# EAGLE design 411_Preliminary Design_ Group8_rev4_5 (EAGLE 9.6.2)
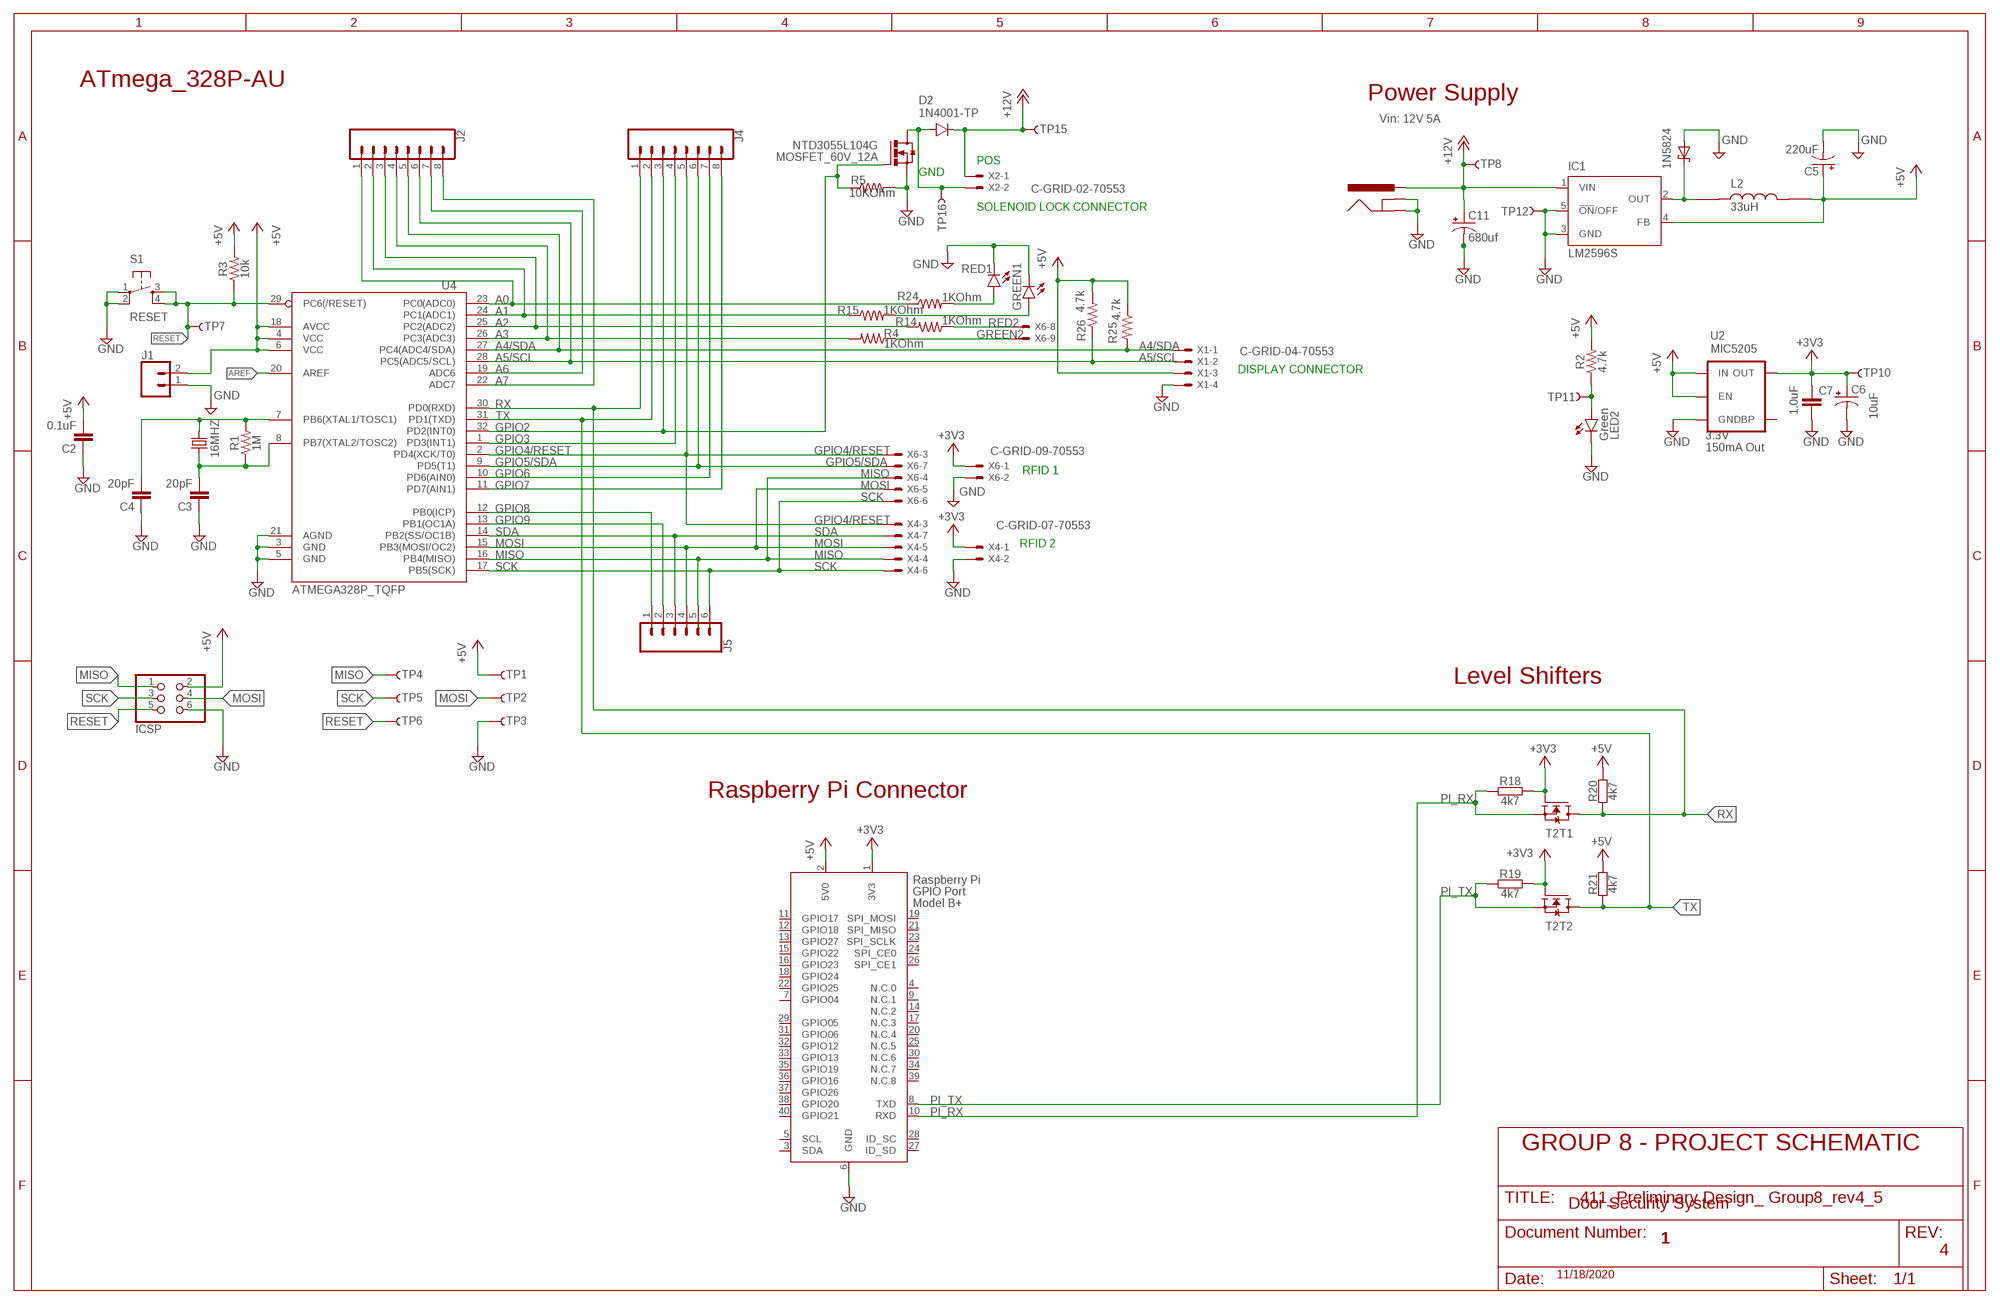
[diagram p0: schematic, sheet 1]

## Parts
1N5824  SCHOTTKY-DIODECB429-15  [CB429-15]
16MHZ  16MHZ  CRYSTALHC49S  [HC49/S]
C2  0.1uF  0.1UF-0603-25V-(+80/-20%)  [0603]
C3  20pF  0.1UF-0603-25V-(+80/-20%)  [0603]
C4  20pF  0.1UF-0603-25V-(+80/-20%)  [0603]
C5  220uF  CPOL-US153CLV-0605  [153CLV-0605]
C6  10uF  10UF-POLAR-EIA3216-16V-10%(TANT)  [EIA3216]
C7  1.0uF  1.0UF-0603-16V-10%  [0603]
C11  680uf  CPOL-US153CLV-0605  [153CLV-0605]
D2  1N4001-TP  1N4004  [DO41-10]
GREEN1  LED5MM  [LED5MM]
IC1  LM2596S  [TO263-5]
ICSP  ICSP  PINHD-2X3  [2X03]
J1  CONN_02  [1X02]
J2  CONN_08"  [1X08]
J3  POWER_JACKSUPER_BOMB_DIGITY  [POWER_JACK_SMD_OVERPASTE_SUPER_BOMB_DIGITY]
J4  CONN_08"  [1X08]
J5  CONN_06SILK_FEMALE_PTH  [1X06]
L2  33uH  #B953AS-330M=P3  [IND_#B953AS-330M=P3]
LED2  Green  LED1206  [LED-1206]
MOSFET_60V_12A  NTD3055L104G  [DPAK3]
R1  1M  10KOHM-0603-1/10W-1%  [0603]
R2  4.7k  4.7KOHM-0603-1/10W-1%  [0603]
R3  10k  10KOHM-0603-1/10W-1%  [0603]
R4  1KOhm  R-US_M1406  [M1406]
R5  10KOhm  R-US_M1406  [M1406]
R14  1KOhm  R-US_M1406  [M1406]
R15  1KOhm  R-US_M1406  [M1406]
R18  4k7  RESISTOR-0402  [C0402]
R19  4k7  RESISTOR-0402  [C0402]
R20  4k7  RESISTOR-0402  [C0402]
R21  4k7  RESISTOR-0402  [C0402]
R24  1KOhm  R-US_M1406  [M1406]
R25  4.7k  4.7KOHM-0603-1/10W-1%  [0603]
R26  4.7k  4.7KOHM-0603-1/10W-1%  [0603]
RED1  LED5MM  [LED5MM]
S1  RESET  SWITCH_SPST_4_PINSQUARE  [TACTILE-SWITCH-SMD]
T2  BSS138PS  [SOT363]
TP1  TP-3x5  TEST-POINT3X5  [PAD.03X.05]
TP2  TP-3x5  TEST-POINT3X5  [PAD.03X.05]
TP3  TP-3x5  TEST-POINT3X5  [PAD.03X.05]
TP4  TP-3x5  TEST-POINT3X5  [PAD.03X.05]
TP5  TP-3x5  TEST-POINT3X5  [PAD.03X.05]
TP6  TP-3x5  TEST-POINT3X5  [PAD.03X.05]
TP7  TP-3x5  TEST-POINT3X5  [PAD.03X.05]
TP8  TP-3x5  TEST-POINT3X5  [PAD.03X.05]
TP10  TP-3x5  TEST-POINT3X5  [PAD.03X.05]
TP11  TP-3x5  TEST-POINT3X5  [PAD.03X.05]
TP12  TP-3x5  TEST-POINT3X5  [PAD.03X.05]
TP15  TP-3x5  TEST-POINT3X5  [PAD.03X.05]
TP16  TP-3x5  TEST-POINT3X5  [PAD.03X.05]
U2  MIC5205  MIC52053.3V  [SOT23-5]
U4  ATMEGA328P_TQFP  [TQFP32-08]
X1  C-GRID-04-70553  [70553-04]
X2  C-GRID-02-70553  [70553-02]
X4  C-GRID-07-70553  [70553-07]
X5  RASPI_BOARD_B+_E4P  [RASPI_BOARD_B+_EDGES_4DRILL_PAD]
X6  C-GRID-09-70553  [70553-09]

## Nets
+3V3: C6.+ C7.1 R18.2 R19.2 T2.2(T1:G) T2.5(T2:G) TP10.P$1 U2.5(OUT) X4.1 X5.1(3V3) X6.1
+5V: C2.2 C5.+ IC1.4(FB) ICSP.2 J1.2 L2.2 R2.2 R3.2 R20.2 R21.2 R25.1 R26.2 TP1.P$1 U2.1(IN) U2.3(EN) U4.4(VCC) U4.6(VCC) U4.18(AVCC) X1.3 X5.2(5V0)
+12V: C11.+ D2.C IC1.1(VIN) J3.VIN0(PWR) TP8.P$1 TP15.P$1 X2.1
A0: J2.1 R24.1 U4.23(PC0(ADC0))
A1: J2.2 R15.1 U4.24(PC1(ADC1))
A2: J2.3 R14.2 U4.25(PC2(ADC2))
A3: J2.4 R4.2 U4.26(PC3(ADC3))
A4/SDA: J2.5 R25.2 U4.27(PC4(ADC4/SDA)) X1.1
A5/SCL: J2.6 R26.1 U4.28(PC5(ADC5/SCL)) X1.2
A6: J2.7 U4.19(ADC6)
A7: J2.8 U4.22(ADC7)
AREF: U4.20(AREF)
GND: 1N5824.A C2.1 C3.1 C4.1 C5.- C6.- C7.2 C11.- GREEN1.K(C) IC1.3(GND) IC1.5(!ON!/OFF) ICSP.6 J1.1 J3.GND(GNDBREAK) J3.P$4(GND) LED2.C MOSFET_60V_12A.2(S) R5.2 RED1.K(C) S1.1 S1.2 TP3.P$1 TP12.P$1 U2.2(GND) U4.3(GND) U4.5(GND) U4.21(AGND) X1.4 X4.2 X5.6(GND) X6.2
GPIO2: J4.3 MOSFET_60V_12A.1(G) R5.1 U4.32(PD2(INT0))
GPIO3: J4.4 U4.1(PD3(INT1))
GPIO4/RESET: J4.5 U4.2(PD4(XCK/T0)) X4.3 X6.3
GPIO5/SDA: J4.6 U4.9(PD5(T1)) X6.7
GPIO6: J4.7 U4.10(PD6(AIN0))
GPIO7: J4.8 U4.11(PD7(AIN1))
GPIO8: J5.1 U4.12(PB0(ICP))
GPIO9: J5.2 U4.13(PB1(OC1A))
GREEN2: R4.1 X6.9
MISO: ICSP.1 J5.5 TP4.P$1 U4.16(PB4(MISO)) X4.4 X6.4
MOSI: ICSP.4 J5.4 TP2.P$1 U4.15(PB3(MOSI/OC2)) X4.5 X6.5
N$1: 1N5824.C IC1.2(OUT) L2.1
N$2: LED2.A R2.1 TP11.P$1
N$3: 16MHZ.2 C4.2 R1.2 U4.7(PB6(XTAL1/TOSC1))
N$4: 16MHZ.1 C3.2 R1.1 U4.8(PB7(XTAL2/TOSC2))
N$5: D2.A MOSFET_60V_12A.3(D) TP16.P$1 X2.2
N$9: GREEN1.A R15.2
N$12: R24.2 RED1.A
PI_RX: R18.1 T2.1(T1:S) X5.10(RXD)
PI_TX: R19.1 T2.4(T2:S) X5.8(TXD)
RED2: R14.1 X6.8
RESET: ICSP.5 R3.1 S1.3 S1.4 TP6.P$1 TP7.P$1 U4.29(PC6(/RESET))
RX: J4.1 R20.1 T2.6(T1:D) U4.30(PD0(RXD))
SCK: ICSP.3 J5.6 TP5.P$1 U4.17(PB5(SCK)) X4.6 X6.6
SDA: J5.3 U4.14(PB2(SS/OC1B)) X4.7
TX: J4.2 R21.1 T2.3(T2:D) U4.31(PD1(TXD))
Unconnected: U2.4(BP) X5.3(SDA) X5.4(N.C.0) X5.5(SCL) X5.7(GPIO04) X5.9(N.C.1) X5.11(GPIO17) X5.12(GPIO18) X5.13(GPIO27) X5.14(N.C.2) X5.15(GPIO22) X5.16(GPIO23) X5.17(N.C.3) X5.18(GPIO24) X5.19(SPI_MOSI) X5.20(N.C.4) X5.21(SPI_MISO) X5.22(GPIO25) X5.23(SPI_SCLK) X5.24(SPI_CE0) X5.25(N.C.5) X5.26(SPI_CE1) X5.27(ID_SD) X5.28(ID_SC) X5.29(GPIO05) X5.30(N.C.6) X5.31(GPIO06) X5.32(GPIO12) X5.33(GPIO13) X5.34(N.C.7) X5.35(GPIO19) X5.36(GPIO16) X5.37(GPIO26) X5.38(GPIO20) X5.39(N.C.8) X5.40(GPIO21)

## Notes on the sheet
- ATmega_328P-AU
- Power Supply
- Vin: 12V 5A
- POS
- GND
- SOLENOID LOCK CONNECTOR
- DISPLAY CONNECTOR
- 3.3V
  150mA Out
- RFID 1
- RFID 2
- Level Shifters
- Level Shifter
- Raspberry Pi Connector
- GROUP 8 - PROJECT SCHEMATIC
- Door Security System
- 1
- 4
- 11/18/2020

## Library data of the parts
1N5824 = adafruit:SCHOTTKY-DIODE: Schottky Diode
16MHZ = crystal:CRYSTAL: CRYSTAL; OC_FARNELL: 1667008; OC_NEWARK: unknown
C2 = SparkFun-Capacitors:0.1UF: 0.1µF ceramic capacitors A capacitor is a passive two-terminal electrical component used to store electrical energy temporarily in an electric field.; PROD_ID: CAP-00810
C3 C4 = SparkFun-Capacitors:0.1UF: 0.1µF ceramic capacitors A capacitor is a passive two-terminal electrical component used to store electrical energy temporarily in an electric field.; PROD_ID: CAP-00810; VALUE: 0.1uF
C5 C11 = rcl:CPOL-US: POLARIZED CAPACITOR, American symbol; SPICEPREFIX: C
C6 = SparkFun-Capacitors:10UF-POLAR: 10.0µF polarized capacitors A capacitor is a passive two-terminal electrical component used to store electrical energy temporarily in an electric field.; PROD_ID: CAP-00811
C7 = SparkFun-Capacitors:1.0UF: 1µF ceramic capacitors A capacitor is a passive two-terminal electrical component used to store electrical energy temporarily in an electric field.; PROD_ID: CAP-00868
D2 = diode:1N4004: DIODE general purpose rectifier, 1 A
GREEN1 = led:LED: LED OSRAM: - CHIPLED LG R971, LG N971, LY N971, LG Q971, LY Q971, LO R971, LY R971 LH N974, LH R974 LS Q976, LO Q976, LY Q976 LO Q996 - Hyper CHIPLED LW Q18S LB Q993, LB Q99A, LB R99A - SideLED LS A670, LO A670, LY A670, LG A670, LP A670 LB A673, LV A673, LT A673, LW A673 LH A674 LY A675 LS A676, LA A676, LO A676, LY A676, LW A676 LS A679, LY A679, LG A679 - Hyper Micro SIDELED® LS Y876, LA Y876, LO Y876, LY Y876 LT Y87S - SmartLED LW L88C, LW L88S LB L89C, LB L89S, LG L890 LS L89K, LO L89K, LY L89K LS L896, LA L896, LO L896, LY L896 - TOPLED LS T670, LO T670, LY T670, LG T670, LP T670 LSG T670, LSP T670, LSY T670, LOP T670, LYG T670 LG T671, LOG T671, LSG T671 LB T673, LV T673, LT T673, LW T673 LH T674 LS T676, LA T676, LO T676, LY T676, LB T676, LH T676, LSB T676, LW T676 LB T67C, LV T67C, LT T67C, LS T67K, LO T67K, LY T67K, LW E67C LS E67B, LA E67B, LO E67B, LY E67B, LB E67C, LV E67C, LT E67C LW T67C LS T679, LY T679, LG T679 LS T770, LO T770, LY T770, LG T770, LP T770 LB T773, LV T773, LT T773, LW T773 LH T774 LS E675, LA E675, LY E675, LS T675 LS T776, LA T776, LO T776, LY T776, LB T776 LHGB T686 LT T68C, LB T68C - Hyper Mini TOPLED® LB M676 - Mini TOPLED Santana® LG M470 LS M47K, LO M47K, LY M47K Source: http://www.osram.convergy.de LUXEON: - LUMILED® LXK2-PW12-R00, LXK2-PW12-S00, LXK2-PW14-U00, LXK2-PW14-V00 LXK2-PM12-R00, LXK2-PM12-S00, LXK2-PM14-U00 LXK2-PE12-Q00, LXK2-PE12-R00, LXK2-PE12-S00, LXK2-PE14-T00, LXK2-PE14-U00 LXK2-PB12-K00, LXK2-PB12-L00, LXK2-PB12-M00, LXK2-PB14-N00, LXK2-PB14-P00, LXK2-PB14-Q00 LXK2-PR12-L00, LXK2-PR12-M00, LXK2-PR14-Q00, LXK2-PR14-R00 LXK2-PD12-Q00, LXK2-PD12-R00, LXK2-PD12-S00 LXK2-PH12-R00, LXK2-PH12-S00 LXK2-PL12-P00, LXK2-PL12-Q00, LXK2-PL12-R00 Source: www.luxeon.com KINGBRIGHT: KA-3528ASYC Source: www.kingbright.com
IC1 = national-semiconductor:LM2596: SIMPLE SWITCHER® Power Converter 150 kHz 3A Step-Down Voltage Regulator Source: http://www.national.com/ds/LM/LM2596.pdf; MF: NATIONAL SEMICONDUCTOR; MPN: LM2596S-ADJ/NOPB; OC_FARNELL: 9494367; OC_NEWARK: 41K3842
ICSP = pinhead:PINHD-2X3: PIN HEADER
J1 = SparkFun-Connectors:CONN_02: Multi connection point. Often used as Generic Header-pin footprint for 0.1 inch spaced/style header connections On any of the 0.1 inch spaced packages, you can populate with these: Break Away Headers - Straight <https://www.sparkfun.com/products/116> (PRT-00116) Break Away Male Headers - Right Angle <https://www.sparkfun.com/products/553> (PRT-00553) Female Headers <https://www.sparkfun.com/products/115> (PRT-00115) Break Away Headers - Machine Pin <https://www.sparkfun.com/products/117> (PRT-00117) Break Away Female Headers - Swiss Machine Pin <https://www.sparkfun.com/products/743> (PRT-00743) For SCREWTERMINALS and SPRING TERMINALS visit here: Screw Terimnals on SparkFun.com <https://www.sparkfun.com/search/results?term=Screw+Terminals> (5mm/3.5mm/2.54mm spacing) This device is also useful as a general connection point to wire up your design to another part of your project. Our various solder wires solder well into these plated through hole pads. Hook-Up Wire - Assortment (Stranded, 22 AWG) <https://www.sparkfun.com/products/11375> (PRT-11375) Hook-Up Wire - Assortment (Solid Core, 22 AWG) <https://www.sparkfun.com/products/11367> (PRT-11367) View the entire wire category on our website here <https://www.sparkfun.com/categories/141> Special notes: Molex polarized connector foot print use with: PRT-08233 with associated crimp pins and housings. 2.54_SCREWTERM for use with PRT-10571. 3.5mm Screw Terminal footprints for PRT-08084 5mm Screw Terminal footprints for use with PRT-08432
J2 J4 = SparkFun-Connectors:CONN_08: Multi connection point. Often used as Generic Header-pin footprint for 0.1 inch spaced/style header connections On any of the 0.1 inch spaced packages, you can populate with these: Break Away Headers - Straight <https://www.sparkfun.com/products/116> (PRT-00116) Break Away Male Headers - Right Angle <https://www.sparkfun.com/products/553> (PRT-00553) Female Headers <https://www.sparkfun.com/products/115> (PRT-00115) Break Away Headers - Machine Pin <https://www.sparkfun.com/products/117> (PRT-00117) Break Away Female Headers - Swiss Machine Pin <https://www.sparkfun.com/products/743> (PRT-00743) Arduino Stackable Header - 8 Pin <https://www.sparkfun.com/products/9279> (PRT-09279) For SCREWTERMINALS and SPRING TERMINALS visit here: Screw Terimnals on SparkFun.com <https://www.sparkfun.com/search/results?term=Screw+Terminals> (5mm/3.5mm/2.54mm spacing) This device is also useful as a general connection point to wire up your design to another part of your project. Our various solder wires solder well into these plated through hole pads. Hook-Up Wire - Assortment (Stranded, 22 AWG) <https://www.sparkfun.com/products/11375> (PRT-11375) Hook-Up Wire - Assortment (Solid Core, 22 AWG) <https://www.sparkfun.com/products/11367> (PRT-11367) View the entire wire category on our website here <https://www.sparkfun.com/categories/141> Special notes: Molex polarized connector foot print use with SKU : PRT-08231 with associated crimp pins and housings. 1MM SMD Version SKU: PRT-10208 NOTES ON THE VARIANTS LOCK and LOCK_LONGPADS... This footprint was designed to help hold the alignment of a through-hole component (i.e. 6-pin header) while soldering it into place. You may notice that each hole has been shifted either up or down by 0.005 of an inch from it's more standard position (which is a perfectly straight line). This slight alteration caused the pins (the squares in the middle) to touch the edges of the holes. Because they are alternating, it causes a "brace" to hold the component in place. 0.005 has proven to be the perfect amount of "off-center" position when using our standard breakaway headers. Although looks a little odd when you look at the bare footprint, once you have a header in there, the alteration is very hard to notice. Also,if you push a header all the way into place, it is covered up entirely on the bottom side.; PROD_ID: CONN-08438
J3 = Testing:POWER_JACK: Power Jack This is the standard 5.5mm barrel jack for power. The PTH is the most common, proven, reliable, footprint. All others are experimental. The Slot footprint only works if the mill layer is transmitted to the PCB fab house so be warned. Spark Fun Electronics SKU : PRT-00119. Mating wall wart : TOL-00298 (and others); PROD_ID: CONN-08106
J5 = SparkFun-Connectors:CONN_06: Multi connection point. Often used as Generic Header-pin footprint for 0.1 inch spaced/style header connections On any of the 0.1 inch spaced packages, you can populate with these: Break Away Headers - Straight <https://www.sparkfun.com/products/116> (PRT-00116) Break Away Male Headers - Right Angle <https://www.sparkfun.com/products/553> (PRT-00553) Female Headers <https://www.sparkfun.com/products/115> (PRT-00115) Break Away Headers - Machine Pin <https://www.sparkfun.com/products/117> (PRT-00117) Break Away Female Headers - Swiss Machine Pin <https://www.sparkfun.com/products/743> (PRT-00743) Arduino Stackable Header - 6 Pin <https://www.sparkfun.com/products/9280> (PRT-09280) For SCREWTERMINALS and SPRING TERMINALS visit here: Screw Terimnals on SparkFun.com <https://www.sparkfun.com/search/results?term=Screw+Terminals> (5mm/3.5mm/2.54mm spacing) This device is also useful as a general connection point to wire up your design to another part of your project. Our various solder wires solder well into these plated through hole pads. Hook-Up Wire - Assortment (Stranded, 22 AWG) <https://www.sparkfun.com/products/11375> (PRT-11375) Hook-Up Wire - Assortment (Solid Core, 22 AWG) <https://www.sparkfun.com/products/11367> (PRT-11367) View the entire wire category on our website here <https://www.sparkfun.com/categories/141>; PROD_ID: CONN-08437
L2 = _B953AS-330M_P3:#B953AS-330M=P3: Inductor Power Shielded Wirewound 3.9uH 30% 100KHz Ferrite 6A 0.014Ohm DCR 4949 T/R; DESCRIPTION: Inductor with Inductance: 33uH Tol. +/-20%, Package: 4949 (125125); DIGI-KEY_PART_NUMBER: 490-14099-1-ND; MF: Murata; MP: #B953AS-330M=P3; PACKAGE: NONSTANDARD
LED2 = SparkFun-LED:LED: LED (Generic) Standard schematic elements and footprints for 5mm, 3mm, 1206, and 0603 sized LEDs. Generic LEDs with no color specified.; PROD_ID: DIO-09910
MOSFET_60V_12A = Transistor:NTD3055L104G: 12 A, 60 V, Logic Level N−Channel DPAK/IPAK Manufacturer's datasheet <https://www.onsemi.com/pub/Collateral/NTD3055L104-D.PDF>; CREATED_BY: PCBLayout.com; MANUFACTURER: ON SEMICONDUCTORS; MPN: NTD3055L104G; PACKAGE: DPAK-4
R1 = SparkFun-Resistors:10KOHM: 10kΩ resistor A resistor is a passive two-terminal electrical component that implements electrical resistance as a circuit element. Resistors act to reduce current flow, and, at the same time, act to lower voltage levels within circuits. - Wikipedia; PROD_ID: RES-00824; VALUE: 10k
R2 R25 R26 = SparkFun-Resistors:4.7KOHM: 4.7kΩ resistor A resistor is a passive two-terminal electrical component that implements electrical resistance as a circuit element. Resistors act to reduce current flow, and, at the same time, act to lower voltage levels within circuits. - Wikipedia; PROD_ID: RES-07857
R3 = SparkFun-Resistors:10KOHM: 10kΩ resistor A resistor is a passive two-terminal electrical component that implements electrical resistance as a circuit element. Resistors act to reduce current flow, and, at the same time, act to lower voltage levels within circuits. - Wikipedia; PROD_ID: RES-00824
R4 R5 R14 R15 R24 = rcl:R-US_: RESISTOR, American symbol; SPICEPREFIX: R
R18-R21 = we-rcl:RESISTOR: Resistors all kinds in 0603 and 0402
RED1 = led:LED: LED OSRAM: - CHIPLED LG R971, LG N971, LY N971, LG Q971, LY Q971, LO R971, LY R971 LH N974, LH R974 LS Q976, LO Q976, LY Q976 LO Q996 - Hyper CHIPLED LW Q18S LB Q993, LB Q99A, LB R99A - SideLED LS A670, LO A670, LY A670, LG A670, LP A670 LB A673, LV A673, LT A673, LW A673 LH A674 LY A675 LS A676, LA A676, LO A676, LY A676, LW A676 LS A679, LY A679, LG A679 - Hyper Micro SIDELED® LS Y876, LA Y876, LO Y876, LY Y876 LT Y87S - SmartLED LW L88C, LW L88S LB L89C, LB L89S, LG L890 LS L89K, LO L89K, LY L89K LS L896, LA L896, LO L896, LY L896 - TOPLED LS T670, LO T670, LY T670, LG T670, LP T670 LSG T670, LSP T670, LSY T670, LOP T670, LYG T670 LG T671, LOG T671, LSG T671 LB T673, LV T673, LT T673, LW T673 LH T674 LS T676, LA T676, LO T676, LY T676, LB T676, LH T676, LSB T676, LW T676 LB T67C, LV T67C, LT T67C, LS T67K, LO T67K, LY T67K, LW E67C LS E67B, LA E67B, LO E67B, LY E67B, LB E67C, LV E67C, LT E67C LW T67C LS T679, LY T679, LG T679 LS T770, LO T770, LY T770, LG T770, LP T770 LB T773, LV T773, LT T773, LW T773 LH T774 LS E675, LA E675, LY E675, LS T675 LS T776, LA T776, LO T776, LY T776, LB T776 LHGB T686 LT T68C, LB T68C - Hyper Mini TOPLED® LB M676 - Mini TOPLED Santana® LG M470 LS M47K, LO M47K, LY M47K Source: http://www.osram.convergy.de LUXEON: - LUMILED® LXK2-PW12-R00, LXK2-PW12-S00, LXK2-PW14-U00, LXK2-PW14-V00 LXK2-PM12-R00, LXK2-PM12-S00, LXK2-PM14-U00 LXK2-PE12-Q00, LXK2-PE12-R00, LXK2-PE12-S00, LXK2-PE14-T00, LXK2-PE14-U00 LXK2-PB12-K00, LXK2-PB12-L00, LXK2-PB12-M00, LXK2-PB14-N00, LXK2-PB14-P00, LXK2-PB14-Q00 LXK2-PR12-L00, LXK2-PR12-M00, LXK2-PR14-Q00, LXK2-PR14-R00 LXK2-PD12-Q00, LXK2-PD12-R00, LXK2-PD12-S00 LXK2-PH12-R00, LXK2-PH12-S00 LXK2-PL12-P00, LXK2-PL12-Q00, LXK2-PL12-R00 Source: www.luxeon.com KINGBRIGHT: KA-3528ASYC Source: www.kingbright.com; SPICEPREFIX: L
S1 = SparkFun-Electromechanical:SWITCH_SPST_4_PIN; PROD_ID: SWCH-08247
T2 = we-transistor:BSS138PS: BSS138 Dual N-Channel MOSFET (UGS +/-20V, RDS 1Ohm, ID 320mA)
TP1-TP4 TP6-TP8 TP10-TP12 TP15 TP16 = SparkFun-Connectors:TEST-POINT: SparkFun Test Points Bare copper test points for troubleshooting or In-Circuit-Testing. These are used by our Production team for verifying production board runs using pogo-pins on test beds. SparkFun Products: SparkFun LSM9DS1 Breakout <https://www.sparkfun.com/products/13284> SparkFun PSOC <https://www.sparkfun.com/products/13714> SparkFun Load Cell Amplifier <https://www.sparkfun.com/products/13879>
TP5 = SparkFun-Passives:TEST-POINT: Bare copper test points for troubleshooting or ICT
U2 = SparkFun-PowerIC:MIC5205: MIC5205 150mA vreg 3.3V - VREG-00822 5V - VREG-00823; PROD_ID: VREG-00822
U4 = SparkFun-IC-Microcontroller:ATMEGA328P_TQFP: Popular 328P in QFP Storefront component: ATmega328 - TQFP <https://www.sparkfun.com/products/13448> (COM-13448) Datasheet <http://www.sparkfun.com/datasheets/Components/SMD/ATMega328.pdf> SparkFun Products SparkFun RedBoard - Programmed with Arduino <https://www.sparkfun.com/products/12757> (DEV-12757) Arduino Pro Mini 328 - 5V/16MHz <https://www.sparkfun.com/products/11113> (DEV-11113) Arduino Pro Mini 328 - 3.3V/8MHz <https://www.sparkfun.com/products/11114> (DEV-11114) SparkFun OpenLog <https://www.sparkfun.com/products/13712> (DEV-13712) SparkFun MicroView - OLED Arduino Module <https://www.sparkfun.com/products/12923> (DEV-12923) SparkFun Digital Sandbox <https://www.sparkfun.com/products/12651> (DEV-12651) SparkFun PicoBoard <https://www.sparkfun.com/products/11888> (WIG-11888) Arduino Fio <https://www.sparkfun.com/products/10116> (DEV-10116) LilyPad Arduino 328 Main Board <https://www.sparkfun.com/products/13342> (DEV-13342) SparkFun RedStick <https://www.sparkfun.com/products/13741> (DEV-13741) LilyPad MP3 <https://www.sparkfun.com/products/11013> (DEV-11013) LilyPad Arduino SimpleSnap <https://www.sparkfun.com/products/10941> (DEV-10941) SparkFun Stepoko <https://www.sparkfun.com/products/13899> (ROB-13899) SparkFun Geiger Counter <https://www.sparkfun.com/products/11345> (SEN-11345) SparkFun EL Sequencer <https://www.sparkfun.com/products/12781> (COM-12781) Arduino Pro 328 - 5V/16MHz <https://www.sparkfun.com/products/10915> (DEV-10915) CryptoCape <https://www.sparkfun.com/products/12773> (DEV-12773) SparkFun IR Thermometer Evaluation Board - MLX90614 <https://www.sparkfun.com/products/10740> (SEN-10740) SparkFun RedBot Mainboard <https://www.sparkfun.com/products/12097> (ROB-12097) Arduino Pro 328 - 3.3V/8MHz <https://www.sparkfun.com/products/10914> (DEV-10914) SparkFun Block for Intel® Edison - Arduino <https://www.sparkfun.com/products/13036> (DEV-13036) SparkFun Simon Says - Surface Mount Soldering Kit <https://www.sparkfun.com/products/10935> (KIT-10935) SparkFun 7-Segment Serial Display - Red <https://www.sparkfun.com/products/11441> (COM-11441) SparkFun 7-Segment Serial Display - White <https://www.sparkfun.com/products/11629> (COM-11629) SparkFun 7-Segment Serial Display - Yellow <https://www.sparkfun.com/products/11443> (COM-11443) SparkFun 7-Segment Serial Display - Kelly Green <https://www.sparkfun.com/products/11440> (COM-11440) SparkFun 7-Segment Serial Display - Blue <https://www.sparkfun.com/products/11442> (COM-11442) SparkFun OpenSegment Serial Display - 20mm (Blue) <https://www.sparkfun.com/products/11647> (COM-11647) SparkFun OpenSegment Serial Display - 20mm (Green) <https://www.sparkfun.com/products/11646> (COM-11646) SparkFun OpenSegment Serial Display - 20mm (White) <https://www.sparkfun.com/products/11648> (COM-11648) SparkFun OpenSegment Serial Display - 20mm (Red) <https://www.sparkfun.com/products/11644> (COM-11644) SparkFun OpenSegment Serial Display - 20mm (Yellow) <https://www.sparkfun.com/products/11645> (COM-11645) SparkFun OpenSegment Shield <https://www.sparkfun.com/products/13190> (DEV-13190); PROD_ID: IC-09069
X1 = con-molex:C-GRID-04: CONNECTOR wire to board 2.54 mm (0.100") pitch header; MF: MOLEX; OC_FARNELL: unknown; OC_NEWARK: unknown
X2 = con-molex:C-GRID-02: CONNECTOR wire to board 2.54 mm (0.100") pitch header; MF: MOLEX; OC_FARNELL: unknown; OC_NEWARK: unknown
X4 = con-molex:C-GRID-07: CONNECTOR wire to board 2.54 mm (0.100") pitch header; MF: MOLEX; OC_FARNELL: unknown; OC_NEWARK: unknown
X5 = raspberrypi_bastelstube_v13:RASPI_BOARD_B+: Raspberry Pi GPIO connector with markings for the outer dimensions of the Raspberry Pi board model B+ with different sets of drill holes or mounting pads
X6 = con-molex:C-GRID-09: CONNECTOR wire to board 2.54 mm (0.100") pitch header; MF: MOLEX; OC_FARNELL: unknown; OC_NEWARK: unknown

## Board
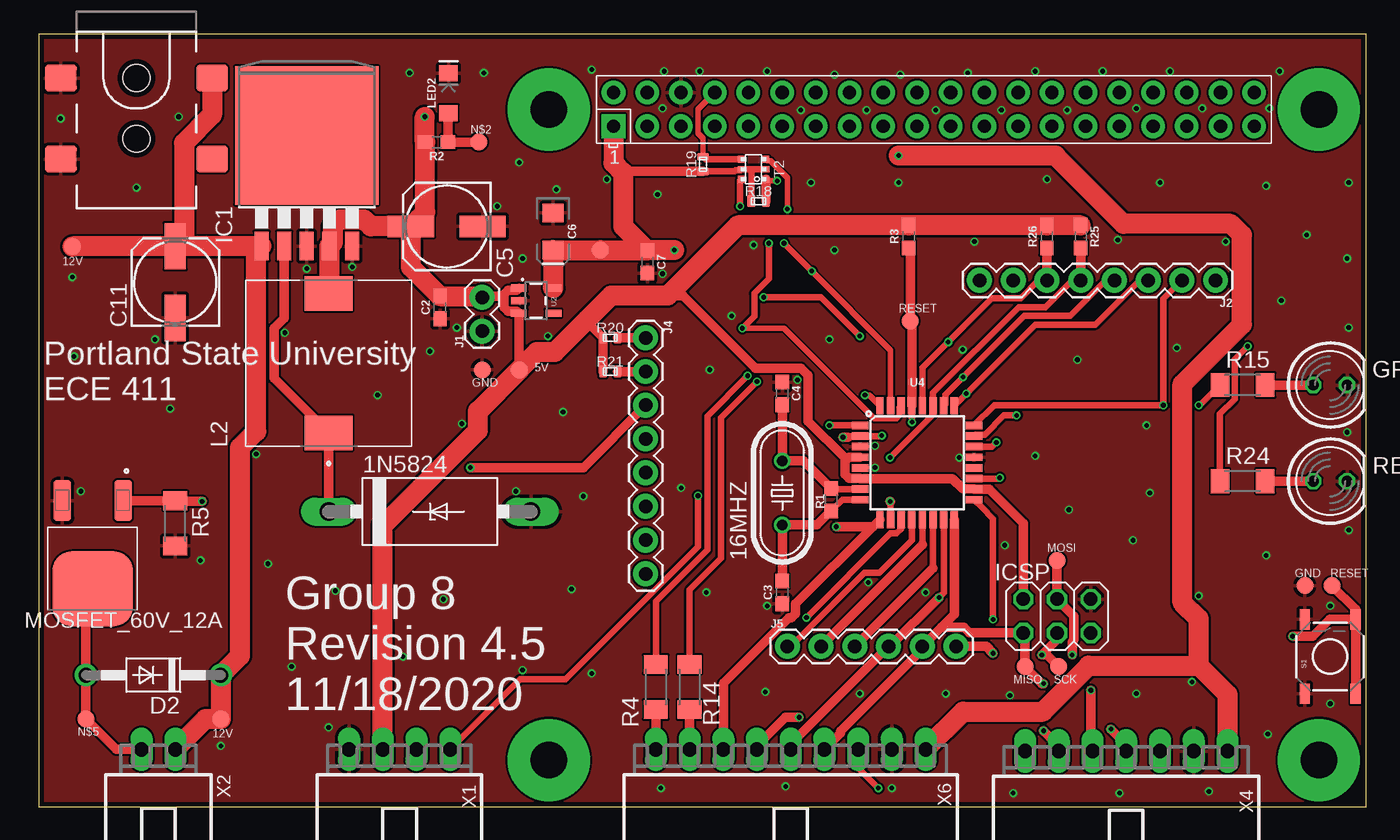
[diagram p1: board, top side]
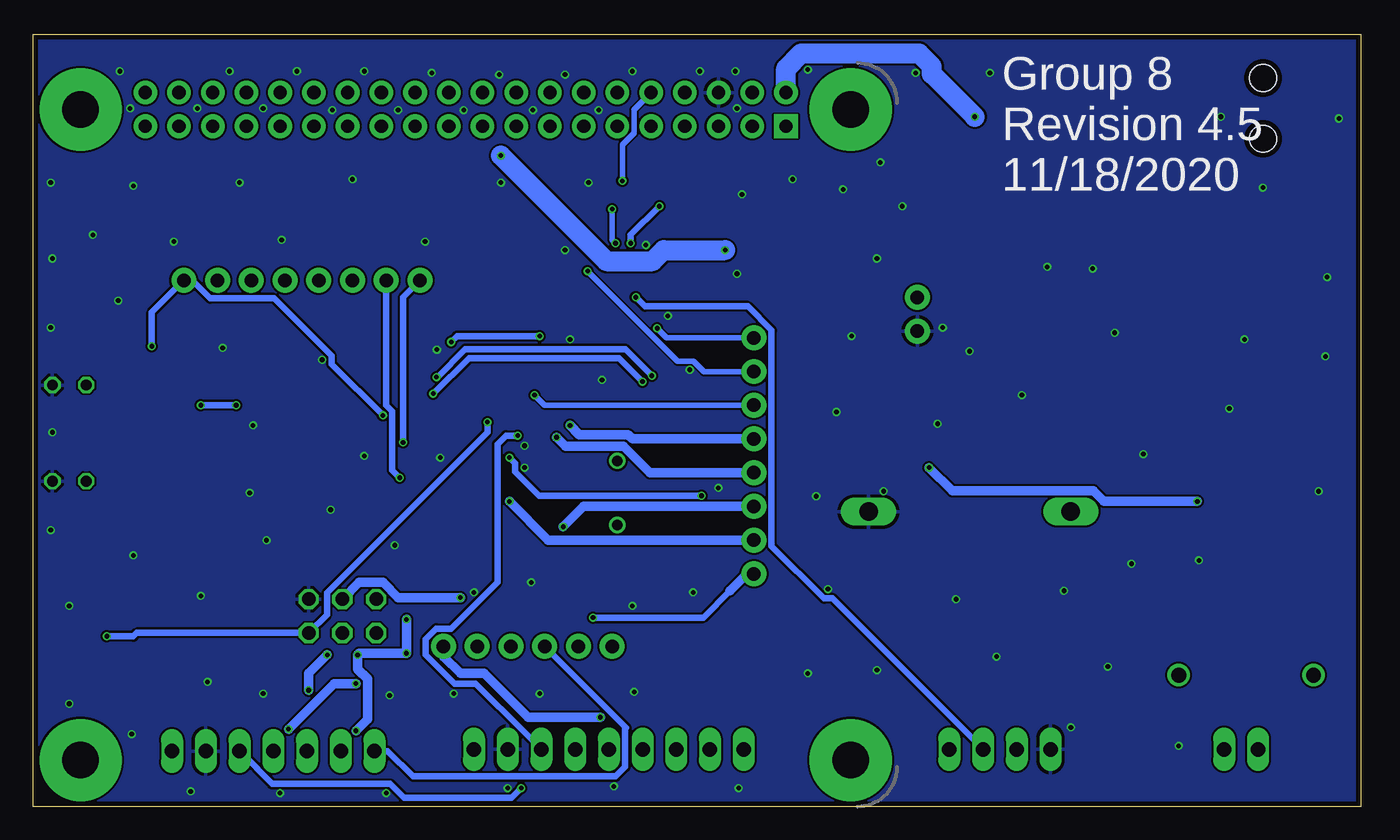
[diagram p2: board, bottom side, seen from below]

Size 100 x 58.16 mm. Coordinates in mm from the lower left corner, seen from the top.
Outline: 0,0 100,0 100,58.16 0,58.16 0,0
Copper layers (1*16): Top 0.035559375mm / dielectric 1.6mm / Bottom 0.035559375mm
Design rules "oshpark-2layer": minimum track width 6mil, minimum drill 10mil, track to track 6mil, track to pad 6mil, pad to pad 6mil, via to via 6mil, smd to smd 6mil, copper to edge 15mil, drill to drill 6mil, minimum pad ring 5mil, minimum via ring 5mil, stop-mask expansion 2.5mil, vias tented up to drill 0mil, thermal gap 10mil

### Footprints (pad centres in the part's own frame; a part is rotated, then mirrored left to right if it is on the bottom)
CB429-15 = drill 1.397 long: A 7.62,0; C -7.62,0
HC49/S = drill 0.813: 1 -2.413,0; 2 2.413,0
0603 = smd 1.1 x 1: 1 -0.85,0; 2 0.85,0
153CLV-0605 = smd 3.5 x 1.6: + 2.7,0; - -2.7,0
EIA3216 = smd 1.4 x 1.6: + 1.4,0; - -1.4,0
DO41-10 = drill 1.118: A 5.08,0; C -5.08,0
LED5MM = drill 0.813 octagon: A -1.27,0; K 1.27,0
TO263-5 = smd 1.067 x 2.159: 1 -3.404,-5.791; 2 -1.702,-5.791; 3 0,-5.791; 4 1.702,-5.791; 5 3.404,-5.791 | smd 10.8 x 10.41: 6 0,2.54
2X03 = drill 1.016 octagon: 1 -2.54,-1.27; 2 -2.54,1.27; 3 0,-1.27; 4 0,1.27; 5 2.54,-1.27; 6 2.54,1.27
1X02 = drill 1.016 pad 1.88: 1 0,0; 2 2.54,0
1X08 = drill 1.016 pad 1.88: 1 0,0; 2 2.54,0; 3 5.08,0; 4 7.62,0; 5 10.16,0; 6 12.7,0; 7 15.24,0; 8 17.78,0
POWER_JACK_SMD_OVERPASTE_SUPER_BOMB_DIGITY = smd 2 x 2.4: GND 0,-5.7; P$4 6.1,-5.7; VIN0 0,5.7; VIN1 6.1,5.7 | hole 2.032: 0,0; 4.572,0
1X06 = drill 1.016 pad 1.88: 1 0,0; 2 2.54,0; 3 5.08,0; 4 7.62,0; 5 10.16,0; 6 12.7,0
IND_#B953AS-330M=P3 = smd 2.6 x 3.6: 1 -5.25,0; 2 5.25,0
LED-1206 = smd 1.2 x 1.4: A -1.5,0; C 1.5,0
DPAK3 = smd 1.31 x 3.08: 1 -2.29,-4.12; 2 2.29,-4.12 | smd 6.09 x 5.63: 3 0,2.51
M1406 = smd 1.4 x 1.8: 1 -1.7,0; 2 1.7,0
C0402 = smd 0.9 x 0.6: 1 0,0.55; 2 0,-0.55
TACTILE-SWITCH-SMD = smd 1.524 x 0.762: 1 -2.794,1.905; 2 2.794,1.905; 3 -2.794,-1.905; 4 2.794,-1.905
SOT363 = smd 0.6 x 0.5: 1 -0.9,0.75; 3 -0.9,-0.75; 4 0.9,-0.75; 6 0.9,0.75 | smd 0.6 x 0.4: 2 -0.9,0; 5 0.9,0
PAD.03X.05 = smd 1.27 x 1.27: P$1 0,0
SOT23-5 = smd 0.55 x 1.2: 1 -0.95,-1.3; 2 0,-1.3; 3 0.95,-1.3; 4 0.95,1.3; 5 -0.95,1.3
TQFP32-08 = smd 1.27 x 0.559: 1 -4.293,2.8; 2 -4.293,2; 3 -4.293,1.2; 4 -4.293,0.4; 5 -4.293,-0.4; 6 -4.293,-1.2; 7 -4.293,-2; 8 -4.293,-2.8; 17 4.293,-2.8; 18 4.293,-2; 19 4.293,-1.2; 20 4.293,-0.4; 21 4.293,0.4; 22 4.293,1.2; 23 4.293,2; 24 4.293,2.8 | smd 0.559 x 1.27: 9 -2.8,-4.293; 10 -2,-4.293; 11 -1.2,-4.293; 12 -0.4,-4.293; 13 0.4,-4.293; 14 1.2,-4.293; 15 2,-4.293; 16 2.8,-4.293; 25 2.8,4.293; 26 2,4.293; 27 1.2,4.293; 28 0.4,4.293; 29 -0.4,4.293; 30 -1.2,4.293; 31 -2,4.293; 32 -2.8,4.293
70553-04 = drill 1.092 long: 1 -3.81,-7.62; 2 -1.27,-7.62; 3 1.27,-7.62; 4 3.81,-7.62
70553-02 = drill 1.092 long: 1 -1.27,-7.62; 2 1.27,-7.62
70553-07 = drill 1.092 long: 1 -7.62,-7.62; 2 -5.08,-7.62; 3 -2.54,-7.62; 4 0,-7.62; 5 2.54,-7.62; 6 5.08,-7.62; 7 7.62,-7.62
RASPI_BOARD_B+_EDGES_4DRILL_PAD = drill 1 pad 1.778 square: 1 8.37,51.23 | drill 1 pad 1.778: 2 8.37,53.77; 3 10.91,51.23; 4 10.91,53.77; 5 13.45,51.23; 6 13.45,53.77; 7 15.99,51.23; 8 15.99,53.77; 9 18.53,51.23; 10 18.53,53.77; 11 21.07,51.23; 12 21.07,53.77; 13 23.61,51.23; 14 23.61,53.77; 15 26.15,51.23; 16 26.15,53.77; 17 28.69,51.23; 18 28.69,53.77; 19 31.23,51.23; 20 31.23,53.77; 21 33.77,51.23; 22 33.77,53.77; 23 36.31,51.23; 24 36.31,53.77; 25 38.85,51.23; 26 38.85,53.77; 27 41.39,51.23; 28 41.39,53.77; 29 43.93,51.23; 30 43.93,53.77; 31 46.47,51.23; 32 46.47,53.77; 33 49.01,51.23; 34 49.01,53.77; 35 51.55,51.23; 36 51.55,53.77; 37 54.09,51.23; 38 54.09,53.77; 39 56.63,51.23; 40 56.63,53.77 | drill 2.75 pad 6.2: 41 3.5,3.5; 42 61.5,3.5; 43 61.5,52.5; 44 3.5,52.5
70553-09 = drill 1.092 long: 1 -10.16,-7.62; 2 -7.62,-7.62; 3 -5.08,-7.62; 4 -2.54,-7.62; 5 0,-7.62; 6 2.54,-7.62; 7 5.08,-7.62; 8 7.62,-7.62; 9 10.16,-7.62

### Placement (x,y rotation side)
1N5824  29.46,22.23 0 top
16MHZ  56.01,23.62 90 top
C2  30.23,37.59 90 top
C3  56.01,16.13 90 top
C4  56.01,31.11 270 top
C5  30.73,43.69 180 top
C6  38.73,43.31 270 top
C7  45.85,41.02 270 top
C11  10.29,39.5 90 top
D2  8.64,9.91 180 top
GREEN1  97.28,31.75 0 top
IC1  20.19,48.01 0 top
ICSP  76.71,14.35 0 top
J1  33.4,35.81 90 top
J2  88.65,39.62 180 top
J3  7.37,54.86 270 top
J4  45.72,35.31 270 top
J5  56.39,12.06 0 top
L2  21.84,33.4 90 top
LED2  30.86,53.72 90 top
MOSFET_60V_12A  4.06,18.92 180 top
R1  59.69,23.11 90 top
R2  29.97,50.04 180 top
R3  65.53,42.93 90 top
R4  46.48,9.02 90 top
R5  10.29,21.34 270 top
R14  49.02,9.02 90 top
R15  90.68,31.75 0 top
R18  54.23,45.59 270 top
R19  50.04,48.39 0 top
R20  43.05,35.31 270 top
R21  43.05,32.77 270 top
R24  90.68,24.51 0 top
R25  78.49,42.93 270 top
R26  75.95,42.93 90 top
RED1  97.28,24.51 0 top
S1  97.28,11.3 90 top
T2  53.85,48.01 180 top
TP1  36.2,32.89 0 top
TP2  76.71,18.54 0 top
TP3  95.38,16.64 0 top
TP4  74.3,10.54 0 top
TP5  76.83,10.54 0 top
TP6  65.66,36.58 0 top
TP7  97.41,16.64 0 top
TP8  2.54,42.16 0 top
TP10  42.29,41.91 0 top
TP11  33.15,50.04 0 top
TP12  33.4,32.89 0 top
TP15  13.72,6.6 0 top
TP16  3.56,6.6 0 top
U2  37.47,38.1 270 top
U4  66.17,25.91 0 top
X1  27.18,-3.3 180 top
X2  9.02,-3.3 180 top
X4  81.92,-3.43 180 top
X5  34.92,0 0 top
X6  56.64,-3.3 180 top

### Tracks (layer width: path | path; a pad name or v marks a point on that pad's centre or on a via)
+3V3  (via drill 0.35)
  Top 0.508: R19.2 52.42,47.84 52.5,47.92 52.86,47.92 T2.5 53.85,48.01 | T2.2 53.85,48.01 | R18.2 53.68,47.84 53.85,48.01
  Top 0.711: R19.2 44.1,47.84 44.02,47.75
  Top 1.524: X5.1 43.3,48.47 44.02,47.75 44.02,43.7 C7.1 | C7.1 45.81,41.91 TP10.P$1 C6.+ 38.73,39.08 U2.5 | X6.1 69.65,7.17 75.65,7.17 79.1,10.61 87.37,10.61 | X4.1 89.53,8.45 87.37,10.61 | 87.37,10.61 87.37,14.16 86.16,15.37 86.16,31.82 90.62,36.29 90.62,43.05 89.78,43.89 81.72,43.89 76.58,49.02 v64.77,49.02 | v47.88,41.91 45.89,41.91 C7.1
  Bottom 1.524: v47.88,41.91 52.51,41.91 53.34,41.08 56.82,41.08 v64.77,49.02
+5V  (via drill 0.35)
  Top 0.711: 60.73,26 60.73,25.02 61.03,24.72 U4.6 68.83,24.71 69.61,23.92 70.45,23.92 U4.18 71.6,23.91 74.17,21.34 ICSP.2 | 60.73,26 61.03,26.3 61.86,26.3 U4.4 | 60.73,26 60.73,26.26 57.96,29.04 57.96,32.47 57.4,33.02 53.97,33.02 48.51,38.48 47.37,38.48 | R21.2 R20.2 41.31,36.5 41.31,36.67 | 35.06,38.23 35.06,37.62 35.35,37.32 36,37.32 U2.3 36.2,37.12 TP1.P$1 | 35.06,38.23 35.06,38.59 35.35,38.88 36,38.88 U2.1 | 35.06,38.23 34.84,38.44 33.31,38.44
  Top 1.524: L2.2 21.89,38.7 IC1.4 22.15,42.47 22.15,43.67 22.68,44.21 24.51,44.21 25.03,43.69 C5.+ | C5.+ 28.03,40.63 C2.2 33.31,38.44 J1.2 | C5.+ 29.12,44.78 R2.2 29.08,50.08 v29.08,51.94 | X1.3 25.91,21.14 33.09,28.32 33.09,29.79 TP1.P$1 37.52,34.22 38.86,34.22 41.31,36.67 43.12,38.48 47.37,38.48 52.67,43.78 R3.2 R26.2 R25.1
  Bottom 1.524: v29.08,51.94 32.31,55.17 32.31,55.75 33.28,56.72 42.16,56.72 43.3,55.58 X5.2
+12V
  Top 1.524: J3.VIN0 13.07,52.08 10.95,49.97 10.95,42.86 C11.+ | C11.+ 10.3,42.22 IC1.1 16.38,41.81 16.38,28.26 15.17,27.05 15.17,11.36 D2.C TP15.P$1 12.57,6.6 X2.1 | C11.+ 2.57,42.2 TP8.P$1
A0  (via drill 0.35)
  Top 0.508: U4.23 70.57,28.02 71.26,28.02 72.7,29.46 v73.66,29.46 | R24.1 88.98,29.57 90.08,30.68 90.08,33.7 v91.06,34.67
  Bottom 0.508: v73.66,29.46 77.52,33.33 77.52,33.95 81.85,38.28 86.66,38.28 88.01,39.62 J2.1 91.06,37.21 v91.06,34.67
A1  (via drill 0.35)
  Top 0.508: U4.24 71.98,30.23 v84.71,30.23 84.71,38.23 J2.2 | v87.38,30.23 87.45,30.23 R15.1
  Bottom 0.508: v84.71,30.23 v87.38,30.23
A2  (via drill 0.35)
  Top 0.508: U4.25 v69.87,31.1 75.06,36.3 79.6,36.3 82.93,39.62 J2.3 | R14.2 49.02,16.34 51.38,18.7 51.38,29.28 v54.1,32
  Bottom 0.508: v54.1,32 55.88,33.78 67.18,33.78 v69.87,31.1
A3  (via drill 0.35)
  Top 0.508: U4.26 68.28,30.32 68.28,31 v69.62,32.34 74.23,36.96 77.72,36.96 80.39,39.62 J2.4 | R4.2 46.48,15.45 50.37,19.33 50.37,29.41 v53.4,32.45
  Bottom 0.508: v53.4,32.45 55.4,34.44 67.46,34.44 69.55,32.34 v69.62,32.34
A4/SDA  (via drill 0.35)
  Top 0.508: J2.5 77.85,39.62 75.84,37.62 73.81,37.62 67.37,31.17 U4.27 67.37,29.51 67.02,29.16 67,29.16 v64.14,26.29 | X1.1 36.25,9.58 39.68,9.58 49.66,19.56 v49.66,23.42
  Top 0.711: R25.2 J2.5
  Bottom 0.508: v64.14,26.29 63.7,25.85 63.7,25.23 61.88,23.42 v49.66,23.42
A5/SCL  (via drill 0.35)
  Top 0.508: U4.28 66.57,33.04 v68.52,34.99 71.81,38.28 73.96,38.28 75.31,39.62 J2.6 | v54.61,38.35 58.93,38.35 v61.85,35.43
  Top 0.711: R26.1 J2.6
  Bottom 0.508: X1.2 29.76,5.63 29.76,5.64 39.79,15.68 40.42,15.68 44.37,19.62 44.37,35.86 46.18,37.66 53.92,37.66 v54.61,38.35 | v61.85,35.43 68.07,35.43 v68.52,34.99
A6  (via drill 0.35)
  Top 0.508: v72.39,24.77 72.33,24.71 U4.19
  Bottom 0.508: J2.7 73.41,30.21 72.95,29.76 72.95,25.33 v72.39,24.77
A7  (via drill 0.35)
  Top 0.508: v72.14,27.43 71.81,27.11 U4.22
  Bottom 0.508: J2.8 72.14,38.35 v72.14,27.43
GND  (via drill 0.35)
  other vias: 1.65,51.82 10.54,51.94 2.54,39.88 2.67,33.91 7.37,46.61 20.19,40.51 23.62,40.64 33.53,55.24 27.94,55.24 18.54,35.69 25.53,30.99 9.91,29.97 16.38,26.54 17.27,18.29 12.19,18.54 8.76,35.18 3.17,23.75 13.72,4.57 21.84,5.97 64.26,1.4 46.86,1.4 56.26,1.52 73.41,1.02 81.41,1.02 88.14,1.14 92.58,5.46 97.28,7.75 97.28,15.11 98.68,36.07 98.55,28.19 98.68,20.83 98.55,41.27 98.68,46.99 92.46,46.74 84.45,46.99 75.95,47.24 64.77,46.99 58.17,46.99 53.85,42.29 46.61,46.1 42.8,47.24 47.12,55.37 59.94,41.91 70.48,42.55 89.41,42.55 81.28,42.67 95.5,43.05 93.6,38.1 85.72,34.54 78.23,33.66 69.6,34.42 59.56,35.18 52.2,36.96 50.55,32.89 48.39,24 50.29,16.13 39.5,29.72 41.02,23.37 35.94,23.75 40.13,16.38 30.48,15.62 22.35,16.26 19.05,10.54 27.43,11.3 36.45,10.29 41.66,10.03 54.74,8.64 61.85,8.51 68.33,8.51 73.15,8.38 82.68,8.51 86.87,9.4 87.38,15.88 92.46,18.92 82.42,20.07 77.6,22.35 83.69,23.62 75.06,26.42 72.77,19.68 66.8,16.13 62.48,16.89 83.44,28.7 38.35,35.43 36.45,41.27 34.54,45.21 38.99,46.48 46.99,40.13 62.99,25.53 69.34,26.29 62.99,27.18 57.15,32.13 54.86,15.11 31.88,28.83 29.46,34.29 31.5,36.07 57.4,52.45 62.36,52.45 67.56,52.45 72.52,52.45 77.47,52.45 82.68,52.58 87.63,52.58 92.71,52.58 93.47,55.37 85.22,55.37 80.14,55.37 75.06,55.37 69.98,55.24 64.9,55.12 59.94,55.12 54.86,55.37 49.78,55.37 46.99,52.58 41.66,55.5 36.2,48.51
  pour Top: 0,57.91 99.95,57.91 99.95,-0.25 0,-0.25
  pour Bottom: 0,58.04 99.95,58.04 99.95,-0.13 0,-0.13
GPIO2  (via drill 0.35)
  Top 0.406: v62.23,30.99 62.58,30.99 U4.32
  Top 0.711: J4.3 41.02,25.53 v32.51,25.53 | v12.32,22.99 10.34,22.99 R5.1 MOSFET_60V_12A.1
  Bottom 0.406: J4.3 61.47,30.23 v62.23,30.99
  Bottom 0.711: v12.32,22.99 19.36,22.99 20.15,23.78 30.77,23.78 v32.51,25.53
GPIO3  (via drill 0.35)
  Top 0.508: U4.1 v59.56,28.7
  Bottom 0.711: v59.56,28.7 58.88,28.02 55.19,28.02 54.86,27.69 J4.4
GPIO4/RESET  (via drill 0.35)
  Top 0.508: 60.95,27.81 61.03,27.89 61.86,27.89 U4.2 63.47,27.91 v63.5,27.94 | v63.25,1.4 61.72,2.92 X6.3
  Top 0.711: v60.58,27.81 60.95,27.81
  Bottom 0.508: X6.3 63.04,5.63 63.04,5.64 66.66,9.27 68.26,9.27 70.43,11.45 70.43,12.62 69.65,13.41 68.52,13.41 65.02,16.91 65.02,27.3 64.39,27.94 v63.5,27.94 | X4.3 83.14,2.88 83.14,2.86 82,1.72 73.11,1.72 72.08,0.69 63.97,0.69 v63.26,1.4 v63.25,1.4
  Bottom 0.711: v60.58,27.81 59.92,27.15 55.54,27.15 53.54,25.15 J4.5
GPIO5/SDA  (via drill 0.35)
  Top 0.711: U4.9 62.83,21.08 | 62.83,21.08 v60.07,21.08 | 62.83,21.08 57.02,15.26 57.02,14.52 56.72,14.22 56.5,14.22 51.56,9.29 X6.7
  Bottom 0.711: v60.07,21.08 58.55,22.61 J4.6
GPIO6  (via drill 0.35)
  Top 0.508: U4.10 64.17,22.95
  Top 0.711: 64.17,22.95 v64.14,22.99
  Bottom 0.711: v64.14,22.99 61.21,20.07 J4.7
GPIO7  (via drill 0.35)
  Top 0.508: U4.11 64.93,21.58 64.93,20.89 64.61,20.57 64.16,20.57 v57.83,14.24
  Bottom 0.508: v57.83,14.24 49.52,14.24 47.5,16.26
  Bottom 0.711: 47.5,16.26 46.23,17.53 J4.8
GPIO8
  Top 0.508: U4.12 65.77,20.05 63.32,17.6 62.19,17.6 56.66,12.06 J5.1
GPIO9
  Top 0.508: U4.13 66.57,19.7
  Top 0.711: 66.57,19.7 J5.2
GREEN2
  Top 0.711: R4.1 X6.9
MISO  (via drill 0.35)
  Top 0.711: X6.4 60.4,5.53 60.4,5.69 66.55,11.84 J5.5 68,13.51 | v75.69,9.27 75.56,9.27 TP4.P$1 74.3,12.95 ICSP.1 70.12,13.08 69.69,13.51 68,13.51 | v80.77,5.84 81.92,4.7 X4.4 | U4.16 68.97,14.48 68,13.51
  Bottom 0.711: v75.69,9.27 77.34,9.27 v80.77,5.84
MOSI  (via drill 0.35)
  Top 0.508: U4.15 68.17,16.1 v67.82,15.75
  Top 0.711: X6.5 56.64,4.7 J5.4 64.14,12.06 v67.82,15.75 | v77.85,11.43 77.85,12.43 77.98,12.55 77.98,14.35 ICSP.4 TP2.P$1 | v79.25,8.76 79.25,4.32 X4.5
  Bottom 0.711: v77.85,11.43 79.25,10.03 v79.25,8.76 | v67.82,15.75 72.5,15.75 73.64,16.89 75.44,16.89 ICSP.4
N$1
  Top 0.711: 1N5824.C L2.1 17.73,32.26 17.73,36.02 18.49,36.78 IC1.2
N$2
  Top 0.711: LED2.A 30.82,52.18 R2.1 TP11.P$1
N$3
  Top 0.508: U4.7 59.75,23.91
  Top 0.711: C4.2 16MHZ.2 57.62,26.04 R1.2 59.75,23.91
N$4
  Top 0.508: U4.8 60.53,23.11 R1.1
  Top 0.711: C3.2 16MHZ.1 58.63,21.21 R1.1
N$5
  Top 0.711: X2.2 5.84,4.32 TP16.P$1 D2.A 3.56,15.9 MOSFET_60V_12A.3
N$9
  Top 0.711: R15.2 GREEN1.A
N$12
  Top 0.711: R24.2 RED1.A
PI_RX  (via drill 0.35)
  Top 0.406: v55.63,47.12 54.89,47.12 54.78,47.23
  Top 0.508: 54.78,47.23 T2.1
  Top 0.711: R18.1 54.78,47.23
  Bottom 0.406: X5.10 54.75,52.48 54.75,50.71 55.63,49.84 v55.63,47.12
PI_TX
  Top 0.406: R19.1 50.04,50.35 49.67,50.71 49.67,52.52 X5.8
  Top 0.508: T2.4 50.22,48.76 R19.1
RED2
  Top 0.711: R14.1 X6.8
RESET  (via drill 0.35)
  Top 0.508: v65.79,28.96 65.77,28.98 U4.29
  Top 0.711: S1.4 S1.3 | S1.4 99.19,14.86 TP7.P$1 | S1.4 97.24,14.1 95.97,12.83 v94.45,12.83 | R3.1 65.66,41.95 TP6.P$1 65.77,36.47 U4.29
  Bottom 0.508: v94.45,12.83 92.46,12.83 92.2,13.08 ICSP.5 77.88,14.45 77.88,16.11 65.79,28.2 v65.79,28.96
RX  (via drill 0.35)
  Top 0.406: U4.30 64.8,30.04 64.8,29.42 64.59,29.21 62.94,29.21 56.12,36.02 v53,36.02
  Top 0.508: T2.6 52.83,47.14 v52.83,45.21 | v53,36.02 53.9,36.92 53.9,38.65 54.99,39.74 v54.99,42.42
  Top 0.711: R20.1 J4.1
  Bottom 0.406: J4.1 52.28,35.31 v53,36.02
  Bottom 0.508: v52.83,45.21 54.99,43.05 v54.99,42.42
SCK  (via drill 0.35)
  Top 0.508: v71.88,14.1 71.88,21.69 71.04,22.53 U4.17
  Top 0.711: v57.28,6.73 56.26,6.73 54.1,4.57 X6.6 | J5.6 71.37,12.06 v71.88,11.56 | TP5.P$1 75.95,11.43 v75.56,11.43 76.71,12.57 ICSP.3 | v75.69,5.71 76.83,4.57 X4.6
  Bottom 0.711: v57.28,6.73 62.74,6.73 66.04,10.03 67.82,10.03 69.09,11.3 J5.6 | v75.69,5.71 74.83,6.58 74.83,9.63 75.56,10.37 v75.56,11.43 75.44,11.56 v71.88,11.56 v71.88,14.1
SDA
  Top 0.508: 67.37,17.96 U4.14
  Top 0.711: J5.3 67.37,17.96
  Bottom 0.508: J5.3 55.34,5.94 55.42,5.86 55.42,2.99 56.13,2.27 71.37,2.27 73.29,4.19 X4.7
TX  (via drill 0.35)
  Top 0.406: T2.3 54.88,48.63 55.12,48.63 56.39,47.36 v56.39,44.99 | v56.13,42.42 v58.23,40.32 64.17,34.38 U4.31
  Top 0.711: R21.1 J4.2
  Bottom 0.406: v56.39,44.99 56.39,42.67 v56.13,42.42 | v58.23,40.32 51.46,33.55 50.27,33.55 49.49,32.77 J4.2

### Text on the board
tPlace: Portland State University / ECE 411 | Group 8 / Revision 4.5 / 11/18/2020
bPlace: Group 8 / Revision 4.5 / 11/18/2020
tNames: N$2 | 12V | RESET | 5V | GND | MOSI | GND | RESET | MISO | SCK | N$5 | 12V